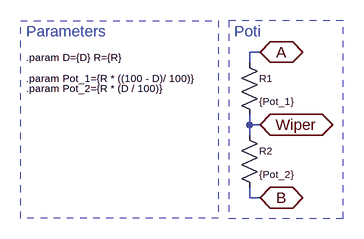
[diagram p0: schematic Poti.asc]
Poti.asc, the LTspice schematic file:
Version 4.1
SHEET 1 880 680
WIRE 192 32 176 32
WIRE 176 48 176 32
WIRE 176 144 176 128
WIRE 192 144 176 144
WIRE 176 160 176 144
WIRE 176 256 176 240
WIRE 192 256 176 256
FLAG 192 32 A
IOPIN 192 32 BiDir
FLAG 192 144 Wiper
IOPIN 192 144 BiDir
FLAG 192 256 B
IOPIN 192 256 BiDir
SYMBOL res 160 32 R0
WINDOW 0 31 40 Left 1
WINDOW 3 31 76 Left 1
SYMATTR InstName R1
SYMATTR Value {Pot_1}
SYMBOL res 160 144 R0
WINDOW 0 31 40 Left 1
WINDOW 3 31 76 Left 1
SYMATTR InstName R2
SYMATTR Value {Pot_2}
TEXT -168 40 Left 1 !.param D={D} R={R}
TEXT -168 72 Left 1 !.param Pot_1={R * ((100 - D)/ 100)}
TEXT -168 88 Left 1 !.param Pot_2={R * (D / 100)}
TEXT 152 0 Left 2 ;Poti
TEXT -168 0 Left 2 ;Parameters
RECTANGLE Normal 320 -16 144 288 2
RECTANGLE Normal -176 -16 128 288 2

The netlist it stands for:
* Poti.asc
R1 A Wiper {Pot_1}
R2 Wiper B {Pot_2}
.param D={D} R={R}
.param Pot_1={R * ((100 - D)/ 100)}
.param Pot_2={R * (D / 100)}
* Poti
* Parameters
.backanno
.end